# Altium schematic sheet MCU.SchDoc
size A3
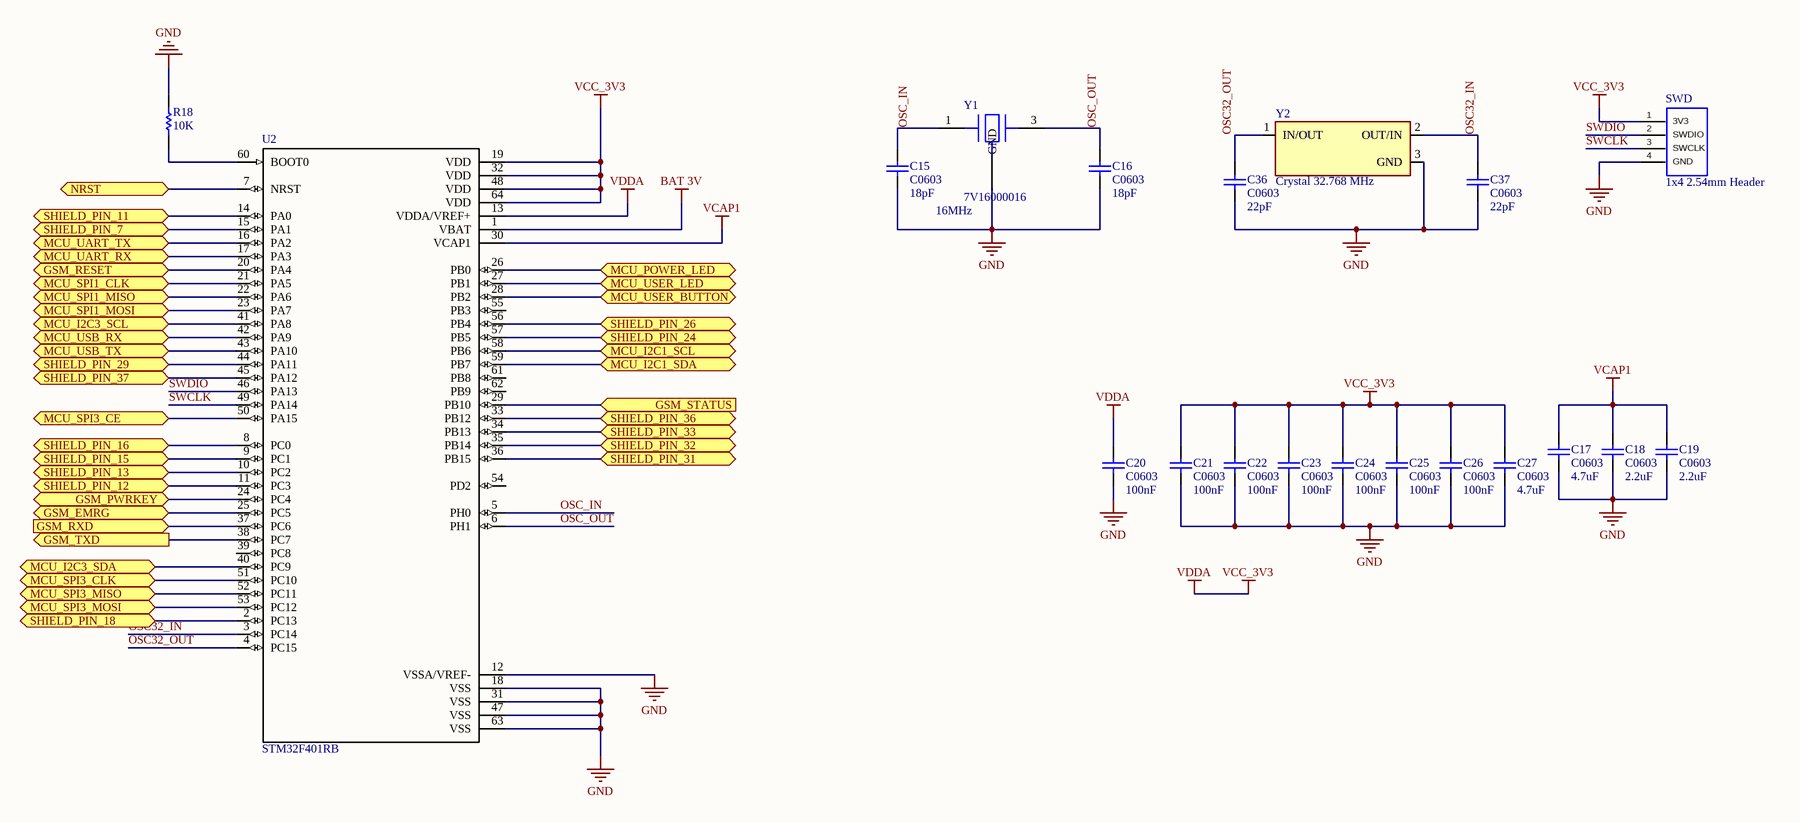
[diagram p0: MCU.SchDoc]

## Parts
C15  C0603  value 18pF  [C0603]
C16  C0603  value 18pF  [C0603]
C17  C0603  value 4.7uF  [C0603]
C18  C0603  value 2.2uF  [C0603]
C19  C0603  value 2.2uF  [C0603]
C20  C0603  value 100nF  [C0603]
C21  C0603  value 100nF  [C0603]
C22  C0603  value 100nF  [C0603]
C23  C0603  value 100nF  [C0603]
C24  C0603  value 100nF  [C0603]
C25  C0603  value 100nF  [C0603]
C26  C0603  value 100nF  [C0603]
C27  C0603  value 4.7uF  [C0603]
C36  C0603  value 22pF  [C0603]
C37  C0603  value 22pF  [C0603]
R18  value 10K  [CC1608-0603]  (hidden comment: Res0603)
SWD  1x4 2.54mm Header  [1x4 2.54mm Header]
U2  STM32F401RB  [STM32F401RE]
Y1  7V16000016  value 16MHz  [7V16000016]
Y2  Crystal 32.768 MHz  [Crystal 32.768 MHz]

## Ports
GSM_EMRG (bidir), GSM_PWRKEY (bidir), GSM_RESET (bidir), GSM_RXD (in), GSM_STATUS (in), GSM_TXD (out), MCU_I2C1_SCL, MCU_I2C1_SDA, MCU_I2C3_SCL, MCU_I2C3_SDA, MCU_POWER_LED, MCU_SPI1_CLK, MCU_SPI1_MISO, MCU_SPI1_MOSI, MCU_SPI3_CE, MCU_SPI3_CLK, MCU_SPI3_MISO, MCU_SPI3_MOSI, MCU_UART_RX, MCU_UART_TX, MCU_USB_RX, MCU_USB_TX, MCU_USER_BUTTON, MCU_USER_LED, NRST, SHIELD_PIN_7, SHIELD_PIN_11, SHIELD_PIN_12, SHIELD_PIN_13, SHIELD_PIN_15, SHIELD_PIN_16, SHIELD_PIN_18, SHIELD_PIN_24, SHIELD_PIN_26, SHIELD_PIN_29, SHIELD_PIN_31, SHIELD_PIN_32, SHIELD_PIN_33, SHIELD_PIN_36, SHIELD_PIN_37

## Nets
BAT 3V: U2.1(VBAT)
GND: C15.1 C16.1 C17.2 C18.2 C19.2 C20.2 C21.1 C22.1 C23.1 C24.1 C25.1 C26.1 C27.1 C36.2 C37.2 R18.1 SWD.4(GND) U2.12(VSSA/VREF-) U2.18(VSS) U2.31(VSS) U2.47(VSS) U2.63(VSS) Y1.2(GND) Y2.3(GND)
VCAP1: C17.1 C18.1 C19.1 U2.30(VCAP1)
VCC_3V3: C20.1 C21.2 C22.2 C23.2 C24.2 C25.2 C26.2 C27.2 SWD.1(3V3) U2.13(VDDA/VREF+) U2.19(VDD) U2.32(VDD) U2.48(VDD) U2.64(VDD)  [also labelled VDDA]
GSM_EMRG: U2.25(PC5) ; port GSM_EMRG
GSM_PWRKEY: U2.24(PC4) ; port GSM_PWRKEY
GSM_RESET: U2.20(PA4) ; port GSM_RESET
GSM_RXD: U2.37(PC6) ; port GSM_RXD
GSM_STATUS: U2.29(PB10) ; port GSM_STATUS
GSM_TXD: U2.38(PC7) ; port GSM_TXD
MCU_I2C1_SCL: U2.58(PB6) ; port MCU_I2C1_SCL
MCU_I2C1_SDA: U2.59(PB7) ; port MCU_I2C1_SDA
MCU_I2C3_SCL: U2.41(PA8) ; port MCU_I2C3_SCL
MCU_I2C3_SDA: U2.40(PC9) ; port MCU_I2C3_SDA
MCU_POWER_LED: U2.26(PB0) ; port MCU_POWER_LED
MCU_SPI1_CLK: U2.21(PA5) ; port MCU_SPI1_CLK
MCU_SPI1_MISO: U2.22(PA6) ; port MCU_SPI1_MISO
MCU_SPI1_MOSI: U2.23(PA7) ; port MCU_SPI1_MOSI
MCU_SPI3_CE: U2.50(PA15) ; port MCU_SPI3_CE
MCU_SPI3_CLK: U2.51(PC10) ; port MCU_SPI3_CLK
MCU_SPI3_MISO: U2.52(PC11) ; port MCU_SPI3_MISO
MCU_SPI3_MOSI: U2.53(PC12) ; port MCU_SPI3_MOSI
MCU_UART_RX: U2.17(PA3) ; port MCU_UART_RX
MCU_UART_TX: U2.16(PA2) ; port MCU_UART_TX
MCU_USB_RX: U2.42(PA9) ; port MCU_USB_RX
MCU_USB_TX: U2.43(PA10) ; port MCU_USB_TX
MCU_USER_BUTTON: U2.28(PB2) ; port MCU_USER_BUTTON
MCU_USER_LED: U2.27(PB1) ; port MCU_USER_LED
NRST: U2.7(NRST) ; port NRST
OSC32_IN: C37.1 U2.3(PC14) Y2.2(OUT/IN)
OSC32_OUT: C36.1 U2.4(PC15) Y2.1(IN/OUT)
OSC_IN: C15.2 U2.5(PH0) Y1.1
OSC_OUT: C16.2 U2.6(PH1) Y1.3
SHIELD_PIN_7: U2.15(PA1) ; port SHIELD_PIN_7
SHIELD_PIN_11: U2.14(PA0) ; port SHIELD_PIN_11
SHIELD_PIN_12: U2.11(PC3) ; port SHIELD_PIN_12
SHIELD_PIN_13: U2.10(PC2) ; port SHIELD_PIN_13
SHIELD_PIN_15: U2.9(PC1) ; port SHIELD_PIN_15
SHIELD_PIN_16: U2.8(PC0) ; port SHIELD_PIN_16
SHIELD_PIN_18: U2.2(PC13) ; port SHIELD_PIN_18
SHIELD_PIN_24: U2.57(PB5) ; port SHIELD_PIN_24
SHIELD_PIN_26: U2.56(PB4) ; port SHIELD_PIN_26
SHIELD_PIN_29: U2.44(PA11) ; port SHIELD_PIN_29
SHIELD_PIN_31: U2.36(PB15) ; port SHIELD_PIN_31
SHIELD_PIN_32: U2.35(PB14) ; port SHIELD_PIN_32
SHIELD_PIN_33: U2.34(PB13) ; port SHIELD_PIN_33
SHIELD_PIN_36: U2.33(PB12) ; port SHIELD_PIN_36
SHIELD_PIN_37: U2.45(PA12) ; port SHIELD_PIN_37
SWCLK: SWD.3(SWCLK) U2.49(PA14)
SWDIO: SWD.2(SWDIO) U2.46(PA13)
NetR18_2: R18.2 U2.60(BOOT0)

Not connected (* = marked no-connect by the designer): U2 39(PC8) 54(PD2) 55(PB3) 61(PB8) 62(PB9); Y1 4,1(GND)

## Library data of the parts
C15-C27 C36 C37 = C0603: Ceramic Chip Capacitor - Standard; Note: Footprint corresponds to dimensions for bulk cassette packaging. This case size has tightened tolerances.; Published: 17-Jul-2002; LatestRevisionDate: 19-Mar-2004; LatestRevisionNote: Silkscreen size reduced.; DatasheetDocument: Mar-2001; PackageDocument: Mar-2001; PackageReference: 0603; Publisher: Altium Limited; Code_JEITA: 0603; Code_IPC: 1608 [0603]; ComponentLink1Description: Manufacturer Link; ComponentLink1URL: http://www.kemet.com/; ComponentLink2Description: Datasheet; ComponentLink2URL: http://www.kemet.com/kemet/web/homepage/kechome.nsf/vapubfilesname/F3102TA.pdf/$file/F3102TA.pdf
R18 = Res0603: Resistor; Manufacturer: Generic Components; Class I: Passive; Published: 8-Jun-2000; Revision: July-2002: Re-released for DXP Platform.; Publisher: Altium Limited; Class II: Resistor
U2 = STM32F401RE